# Altium schematic sheet Altium_Schematic_CO2_Sensor_Rev1.SchDoc: ESP32 Round CO2 Sensor Board
size Tabloid; Date: Oct 15, 2022; DrawnBy: x; Engineer: x; Address1: Mike Rankin; Address2: 0miker0@gmail.com; Address3: @mikerankin; DocumentNumber: 1; Revision: 1; SheetNumber: 1; SheetTotal: 1; ImagePath: x
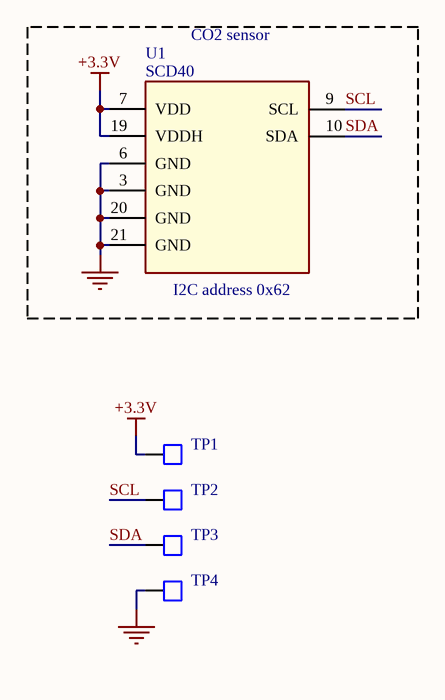
[diagram p0: Altium_Schematic_CO2_Sensor_Rev1.SchDoc]

## Parts
TP1  Test Point, 1mm Top Layer  [TP100TL]  (value not drawn)  (no BOM)
TP2  Test Point, 1mm Top Layer  [TP100TL]  (value not drawn)  (no BOM)
TP3  Test Point, 1mm Top Layer  [TP100TL]  (value not drawn)  (no BOM)
TP4  Test Point, 1mm Top Layer  [TP100TL]  (value not drawn)  (no BOM)
U1  SCD40  [SCD40]

## Nets
+3.3V: TP1.1 U1.7(VDD) U1.19(VDDH)
GND: TP4.1 U1.3(GND) U1.6(GND) U1.20(GND) U1.21(GND)
SCL: TP2.1 U1.9(SCL)
SDA: TP3.1 U1.10(SDA)

## Notes on the sheet
- (near U1) CO2 sensor
- (near U1) I2C address 0x62
- Title
- Size:
- Tabloid
- Number:
- Revision:
- Date:
- Time:
- Sheet
- of

## Library data of the parts
U1 = SCD40: CO2 SENSOR 50 PPM I2C SMD; Manufacturer: Sensirion; Part_Number: SCD40; Part_Footprint: SCD40; Value: SCD40
TP1-TP4 = Test Point, 1mm Top Layer: Part_Number: N/A; Manufacturer: N/A; Part_Footprint: *